# Altium schematic sheet Atmega16-platform.SchDoc
size A3
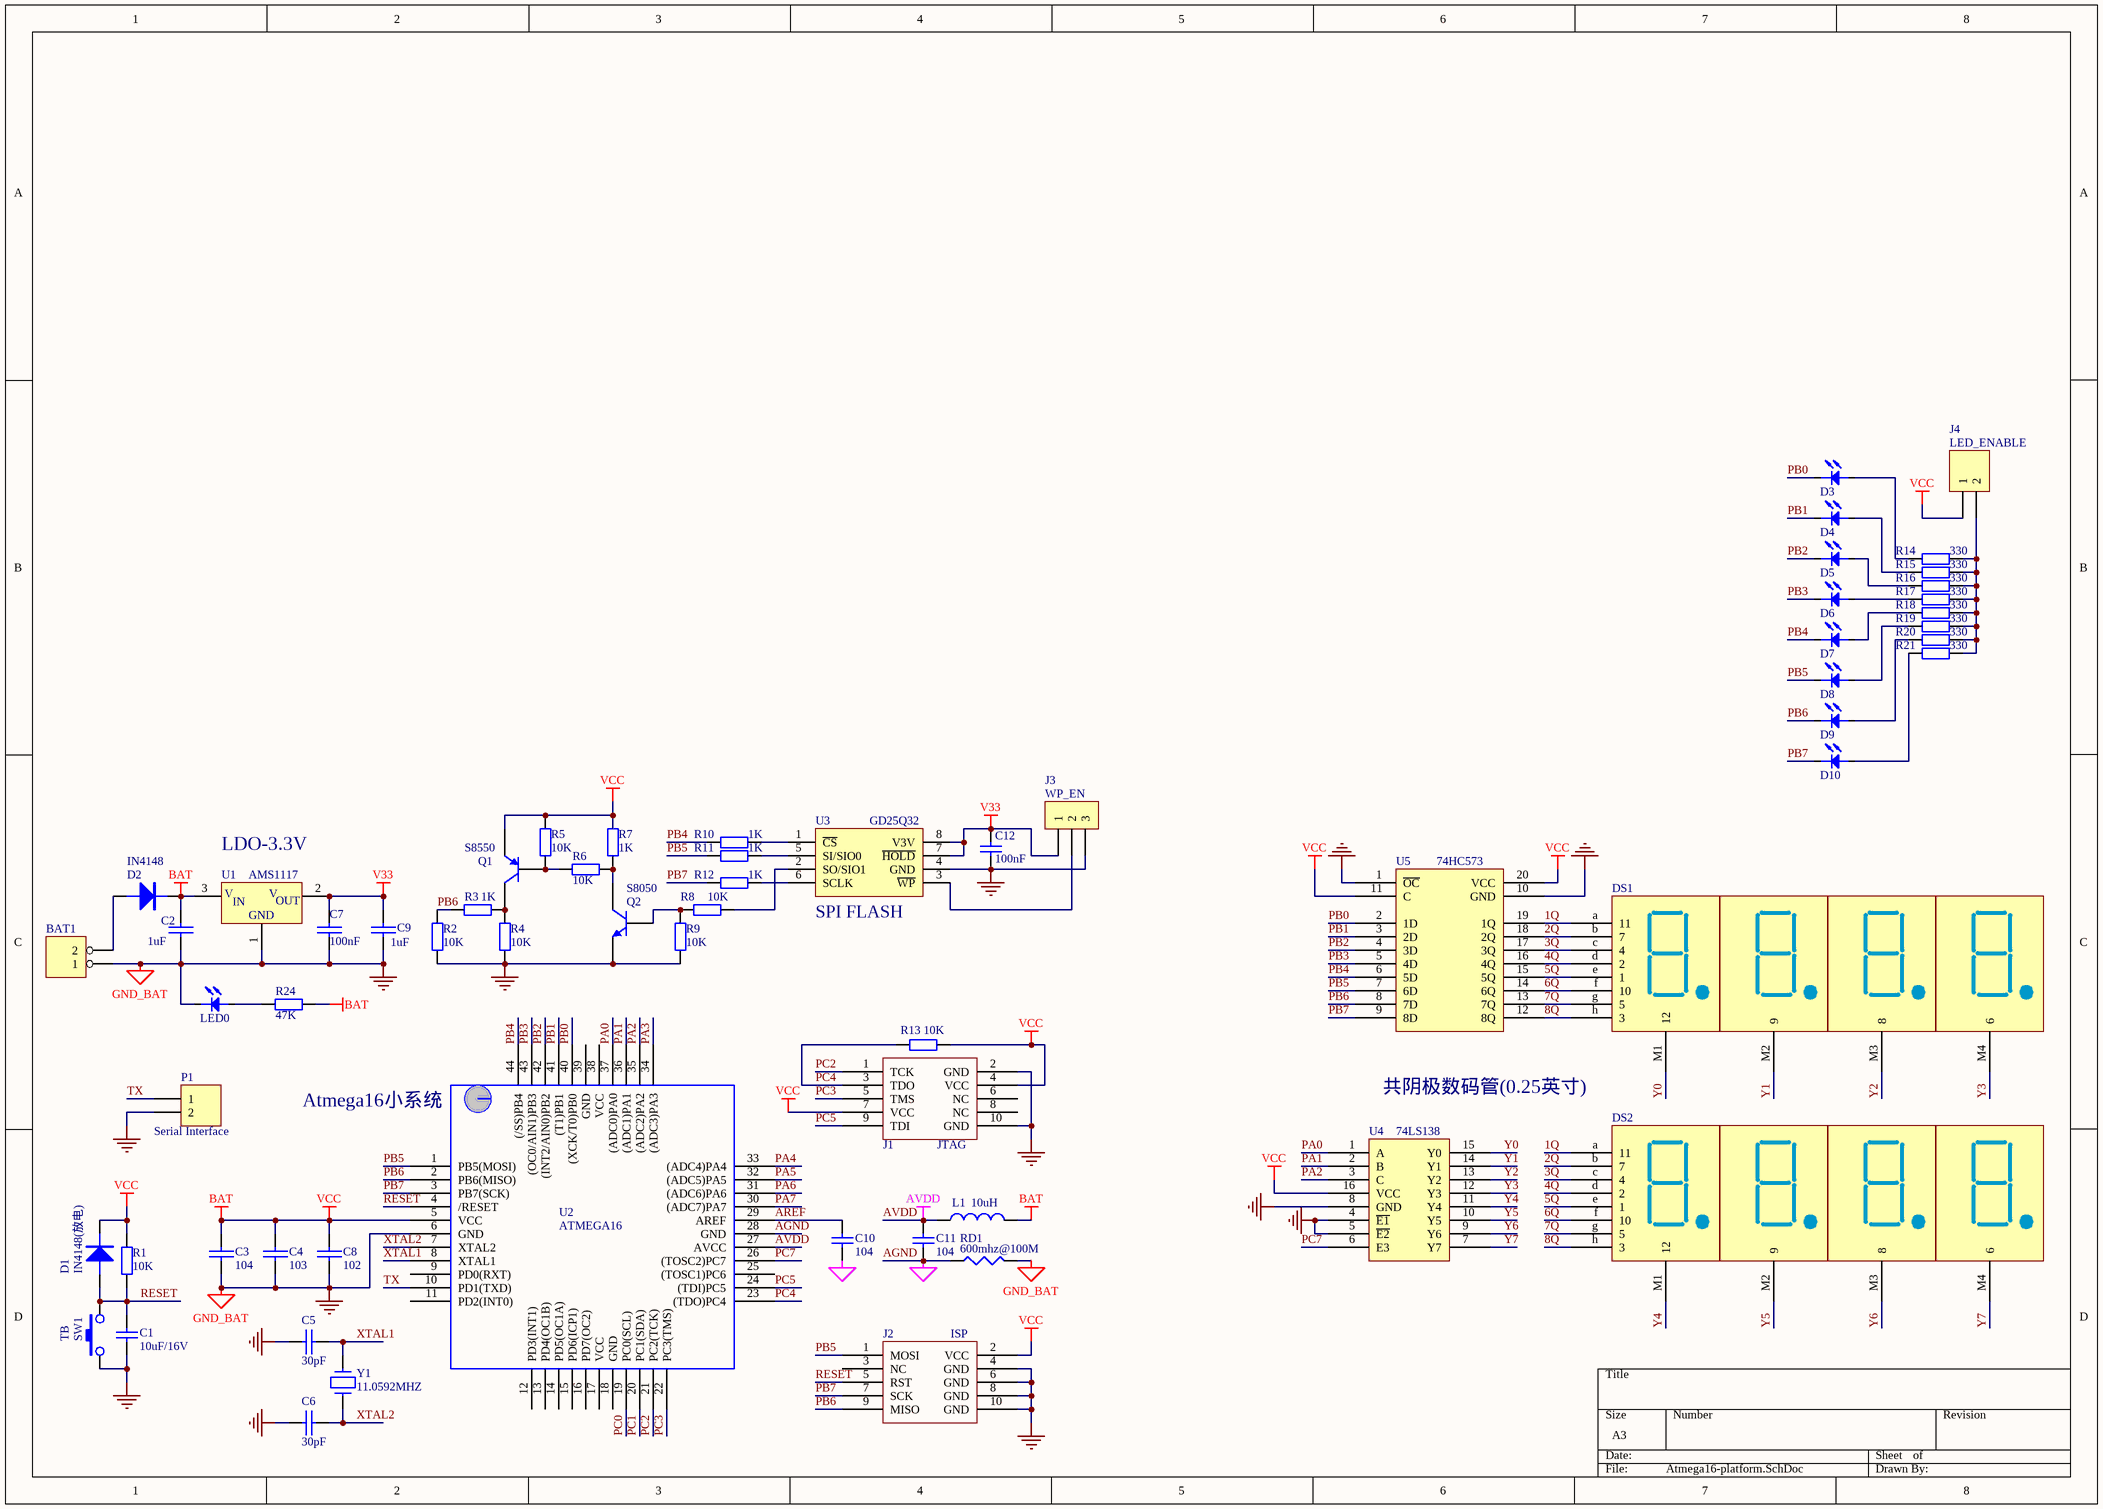
[diagram p0: Atmega16-platform.SchDoc]

## Parts
BAT1  (no value)  [SIP2]
C1  10uF/16V  [10uF/50V]
C2  1uF  [0805]
C3  104  [0603]
C4  103  [0603]
C5  30pF  [0603]
C6  30pF  [0603]
C7  100nF  [0603]
C8  102  [0603]
C9  1uF  [0805]
C10  104  [0603]
C11  104  [0603]
C12  100nF  [0603]
D1  IN4148(放电)  [SOD-123]
D2  IN4148  [SOD-123]
D3  LED  [0603]  (value not drawn)
D4  LED  [0603]  (value not drawn)
D5  LED  [0603]  (value not drawn)
D6  LED  [0603]  (value not drawn)
D7  LED  [0603]  (value not drawn)
D8  LED  [0603]  (value not drawn)
D9  LED  [0603]  (value not drawn)
D10  LED  [0603]  (value not drawn)
DS1  LED_8*4_SEG  [4BIT_8SEG_LED]  (value not drawn)
DS2  LED_8*4_SEG  [4BIT_8SEG_LED]  (value not drawn)
J1  JTAG  [Jtag-10]
J2  ISP  [Jtag-10]
J3  WP_EN  [SIP3]
J4  LED_ENABLE  [SIP2]
L1  10uH  [0603]
LED0  LED  [0603]  (value not drawn)
P1  Serial Interface  [SIP2]
Q1  S8550  [TO-92A]
Q2  S8050  [TO-92A]
R1  value 10K  [0603]  (hidden comment: Res2)
R2  value 10K  [0603]  (hidden comment: Res2)
R3  value 1K  [0603]  (hidden comment: Res2)
R4  value 10K  [0603]  (hidden comment: Res2)
R5  value 10K  [0603]  (hidden comment: Res2)
R6  value 10K  [0603]  (hidden comment: Res2)
R7  value 1K  [0603]  (hidden comment: Res2)
R8  value 10K  [0603]  (hidden comment: Res2)
R9  value 10K  [0603]  (hidden comment: Res2)
R10  value 1K  [0603]  (hidden comment: Res2)
R11  value 1K  [0603]  (hidden comment: Res2)
R12  value 1K  [0603]  (hidden comment: Res2)
R13  value 10K  [0603]  (hidden comment: Res2)
R14  value 330  [0603]  (hidden comment: Res2)
R15  value 330  [0603]  (hidden comment: Res2)
R16  value 330  [0603]  (hidden comment: Res2)
R17  value 330  [0603]  (hidden comment: Res2)
R18  value 330  [0603]  (hidden comment: Res2)
R19  value 330  [0603]  (hidden comment: Res2)
R20  value 330  [0603]  (hidden comment: Res2)
R21  value 330  [0603]  (hidden comment: Res2)
R24  value 47K  [0603]  (hidden comment: Res2)
RD1  600mhz@100M  [0603]
SW1  TB  [AN66]
U1  AMS1117  [SOT223]
U2  ATMEGA16  [TQFP-44A]
U3  GD25Q32  [SO-8]
U4  74LS138  [SOT403-1_N]
U5  74HC573  [SOT339-1]
Y1  11.0592MHZ  [XTAL]

## Nets
AGND: C10.1 C11.1 RD1.1 U2.28(GND)
AVDD: C11.2 L1.2 U2.27(AVCC)
BAT: C2.1 C3.1 C4.1 C8.1 D1.2(K) D2.2(K) J1.4(VCC) J1.7(VCC) J2.2(VCC) J4.1 L1.1 Q1.1(E) R1.2 R5.2 R7.2 R13.2 R24.1 U1.3(VIN) U2.5(VCC) U4.16(VCC) U5.11(C) U5.20(VCC)  [also labelled VCC]
GND: BAT1.1 C1.2 C2.2 C3.2 C4.2 C5.2 C6.2 C7.2 C8.2 C9.2 C12.1 J1.2(GND) J1.10(GND) J2.4(GND) J2.6(GND) J2.8(GND) J2.10(GND) J3.3 LED0.2 P1.2 Q2.1(E) R2.2 R4.2 R9.2 RD1.2 SW1.1 U1.1(GND) U2.6(GND) U3.4(GND) U4.4(~{E1}) U4.5(~{E2}) U4.8(GND) U5.1(~{OC}) U5.10(GND)  [also labelled GND_BAT]
V33: C7.1 C9.1 C12.2 J3.1 U1.2(VOUT) U3.7(~{HOLD}) U3.8(V3V)
1Q: DS1.a(11) DS2.a(11) U5.19(1Q)
2Q: DS1.b(7) DS2.b(7) U5.18(2Q)
3Q: DS1.c(4) DS2.c(4) U5.17(3Q)
4Q: DS1.d(2) DS2.d(2) U5.16(4Q)
5Q: DS1.e(1) DS2.e(1) U5.15(5Q)
6Q: DS1.f(10) DS2.f(10) U5.14(6Q)
7Q: DS1.g(5) DS2.g(5) U5.13(7Q)
8Q: DS1.h(3) DS2.h(3) U5.12(8Q)
AREF: C10.2 U2.29(AREF)
PA0: U2.37((ADC0)PA0) U4.1(A)
PA1: U2.36((ADC1)PA1) U4.2(B)
PA2: U2.35((ADC2)PA2) U4.3(C)
PA3: U2.34((ADC3)PA3)
PA4: U2.33((ADC4)PA4)
PA5: U2.32((ADC5)PA5)
PA6: U2.31((ADC6)PA6)
PA7: U2.30((ADC7)PA7)
PB0: D3.2 U2.40((XCK/T0)PB0) U5.2(1D)
PB1: D4.2 U2.41((T1)PB1) U5.3(2D)
PB2: D5.2 U2.42((INT2/AIN0)PB2) U5.4(3D)
PB3: D6.2 U2.43((OC0/AIN1)PB3) U5.5(4D)
PB4: D7.2 R10.1 U2.44((/SS)PB4) U5.6(5D)
PB5: D8.2 J2.1(MOSI) R11.1 U2.1(PB5(MOSI)) U5.7(6D)
PB6: D9.2 J2.9(MISO) R2.1 R3.1 U2.2(PB6(MISO)) U5.8(7D)
PB7: D10.2 J2.7(SCK) R12.1 U2.3(PB7(SCK)) U5.9(8D)
PC0: U2.19(PC0(SCL))
PC1: U2.20(PC1(SDA))
PC2: J1.1(TCK) U2.21(PC2(TCK))
PC3: J1.5(TMS) U2.22(PC3(TMS))
PC4: J1.3(TDO) R13.1 U2.23((TDO)PC4)
PC5: J1.9(TDI) U2.24((TDI)PC5)
PC7: U2.26((TOSC2)PC7) U4.6(E3)
RESET: C1.1 D1.1(A) J2.5(RST) R1.1 SW1.2 U2.4(/RESET)
TX: P1.1 U2.10(PD1(TXD))
XTAL1: C5.1 U2.8(XTAL1) Y1.1
XTAL2: C6.1 U2.7(XTAL2) Y1.2
Y0: DS1.M1(12) U4.15(Y0)
Y1: DS1.M2(9) U4.14(Y1)
Y2: DS1.M3(8) U4.13(Y2)
Y3: DS1.M4(6) U4.12(Y3)
Y4: DS2.M1(12) U4.11(Y4)
Y5: DS2.M2(9) U4.10(Y5)
Y6: DS2.M3(8) U4.9(Y6)
Y7: DS2.M4(6) U4.7(Y7)
NetBAT1_2: BAT1.2 D2.1(A)
NetD3_1: D3.1 R14.1
NetD4_1: D4.1 R15.1
NetD5_1: D5.1 R16.1
NetD6_1: D6.1 R17.1
NetD7_1: D7.1 R18.1
NetD8_1: D8.1 R19.1
NetD9_1: D9.1 R20.1
NetD10_1: D10.1 R21.1
NetJ3_2: J3.2 U3.3(~{WP})
NetJ4_2: J4.2 R14.2 R15.2 R16.2 R17.2 R18.2 R19.2 R20.2 R21.2
NetLED0_1: LED0.1 R24.2
NetQ1_2: Q1.2(B) R5.1 R6.2
NetQ1_3: Q1.3(C) R3.2 R4.1
NetQ2_2: Q2.2(B) R8.2 R9.1
NetQ2_3: Q2.3(C) R6.1 R7.1
NetR8_1: R8.1 U3.2(SO/SIO1)
NetR10_2: R10.2 U3.1(~{CS})
NetR11_2: R11.2 U3.5(SI/SIO0)
NetR12_2: R12.2 U3.6(SCLK)

Not connected (* = marked no-connect by the designer): J1 6(NC) 8(NC); J2 3(NC); U2 9(PD0(RXT)) 11(PD2(INT0)) 12(PD3(INT1)) 13(PD4(OC1B)) 14(PD5(OC1A)) 15(PD6(ICP1)) 16(PD7(OC2)) 17(VCC) 18(GND) 25((TOSC1)PC6) 38(VCC) 39(GND)

## Notes on the sheet
- (near U1) LDO-3.3V
- (near U3) SPI FLASH
- (near U2) Atmega16小系统
- 共阴极数码管(0.25英寸)
- (in symbol AMS1117) V; IN; OUT

## Library data of the parts
BAT1 = HEADER 2
C1 C12 = Cap: Capacitor; Published: 8-Jun-2000; LatestRevisionDate: 17-Jul-2002; LatestRevisionNote: Re-released for DXP Platform.; Publisher: Altium Limited
  C12: PackageReference: RAD-0.3; Value: 100nF
C2-C9 = CAP: Capacitor
C10 C11 = Cap Semi: Capacitor (Semiconductor SIM Model); Value: 0.1uF; Published: 8-Jun-2000; LatestRevisionDate: 17-Jul-2002; LatestRevisionNote: Re-released for DXP Platform.; PackageReference: C1206; Publisher: Altium Limited
D1 D2 = DIODE
J3 = CON3
J4 P1 = Header 2: Header, 2-Pin; LatestRevisionDate: 17-Jul-2002; LatestRevisionNote: Re-released for DXP Platform.; Publisher: Altium Limited
L1 = BEAD
Q1 = 2N3906: PNP General Purpose Amplifier; Published: 8-Jun-2000; LatestRevisionDate: 15-Jan-2003; LatestRevisionNote: PCB Footprint 'BCY-W3/D4.7' replaced; DatasheetVersion: 1997; PackageVersion: Sep-1998; PackageReference: TO-92A; Publisher: Altium Limited; PackageDescription: TO, Flat Index; 3 In-Line, Axial Leads; Body Dia. 4.5mm; Leads 0.51 x 0.48 mm (max); ComponentLink1Description: Manufacturer Link; ComponentLink1URL: http://www.fairchildsemi.com/; ComponentLink2Description: Datasheet; ComponentLink2URL: http://www.fairchildsemi.com/ds/2N%2F2N3906.pdf
Q2 = 2N3904: NPN General Purpose Amplifier; Published: 8-Jun-2000; LatestRevisionDate: 15-Jan-2003; LatestRevisionNote: PCB Footprint 'BCY-W3/D4.7' replaced; DatasheetVersion: 1997; PackageVersion: Sep-1998; PackageReference: TO-92A; Publisher: Altium Limited; PackageDescription: TO, Flat Index; 3 In-Line, Axial Leads; Body Dia. 4.5mm; Leads 0.51 x 0.48 mm (max); ComponentLink1Description: Manufacturer Link; ComponentLink1URL: http://www.fairchildsemi.com/; ComponentLink2Description: Datasheet; ComponentLink2URL: http://www.fairchildsemi.com/ds/2N%2F2N3904.pdf
R1-R21 R24 = Res2: Resistor; Published: 8-Jun-2000; LatestRevisionDate: 17-Jul-2002; LatestRevisionNote: Re-released for DXP Platform.; PackageReference: AXIAL-0.4; Publisher: Altium Limited; PackageDescription: Axial Device, Thru-Hole; 2 Leads; 0.4 in Pin Spacing
RD1 = RES
SW1 = SW-PB
Y1 = CRYSTAL
U3 = GD25Q32: value: GD25Q32